# EAGLE design nedo1810_v1_0 (EAGLE 5.01)
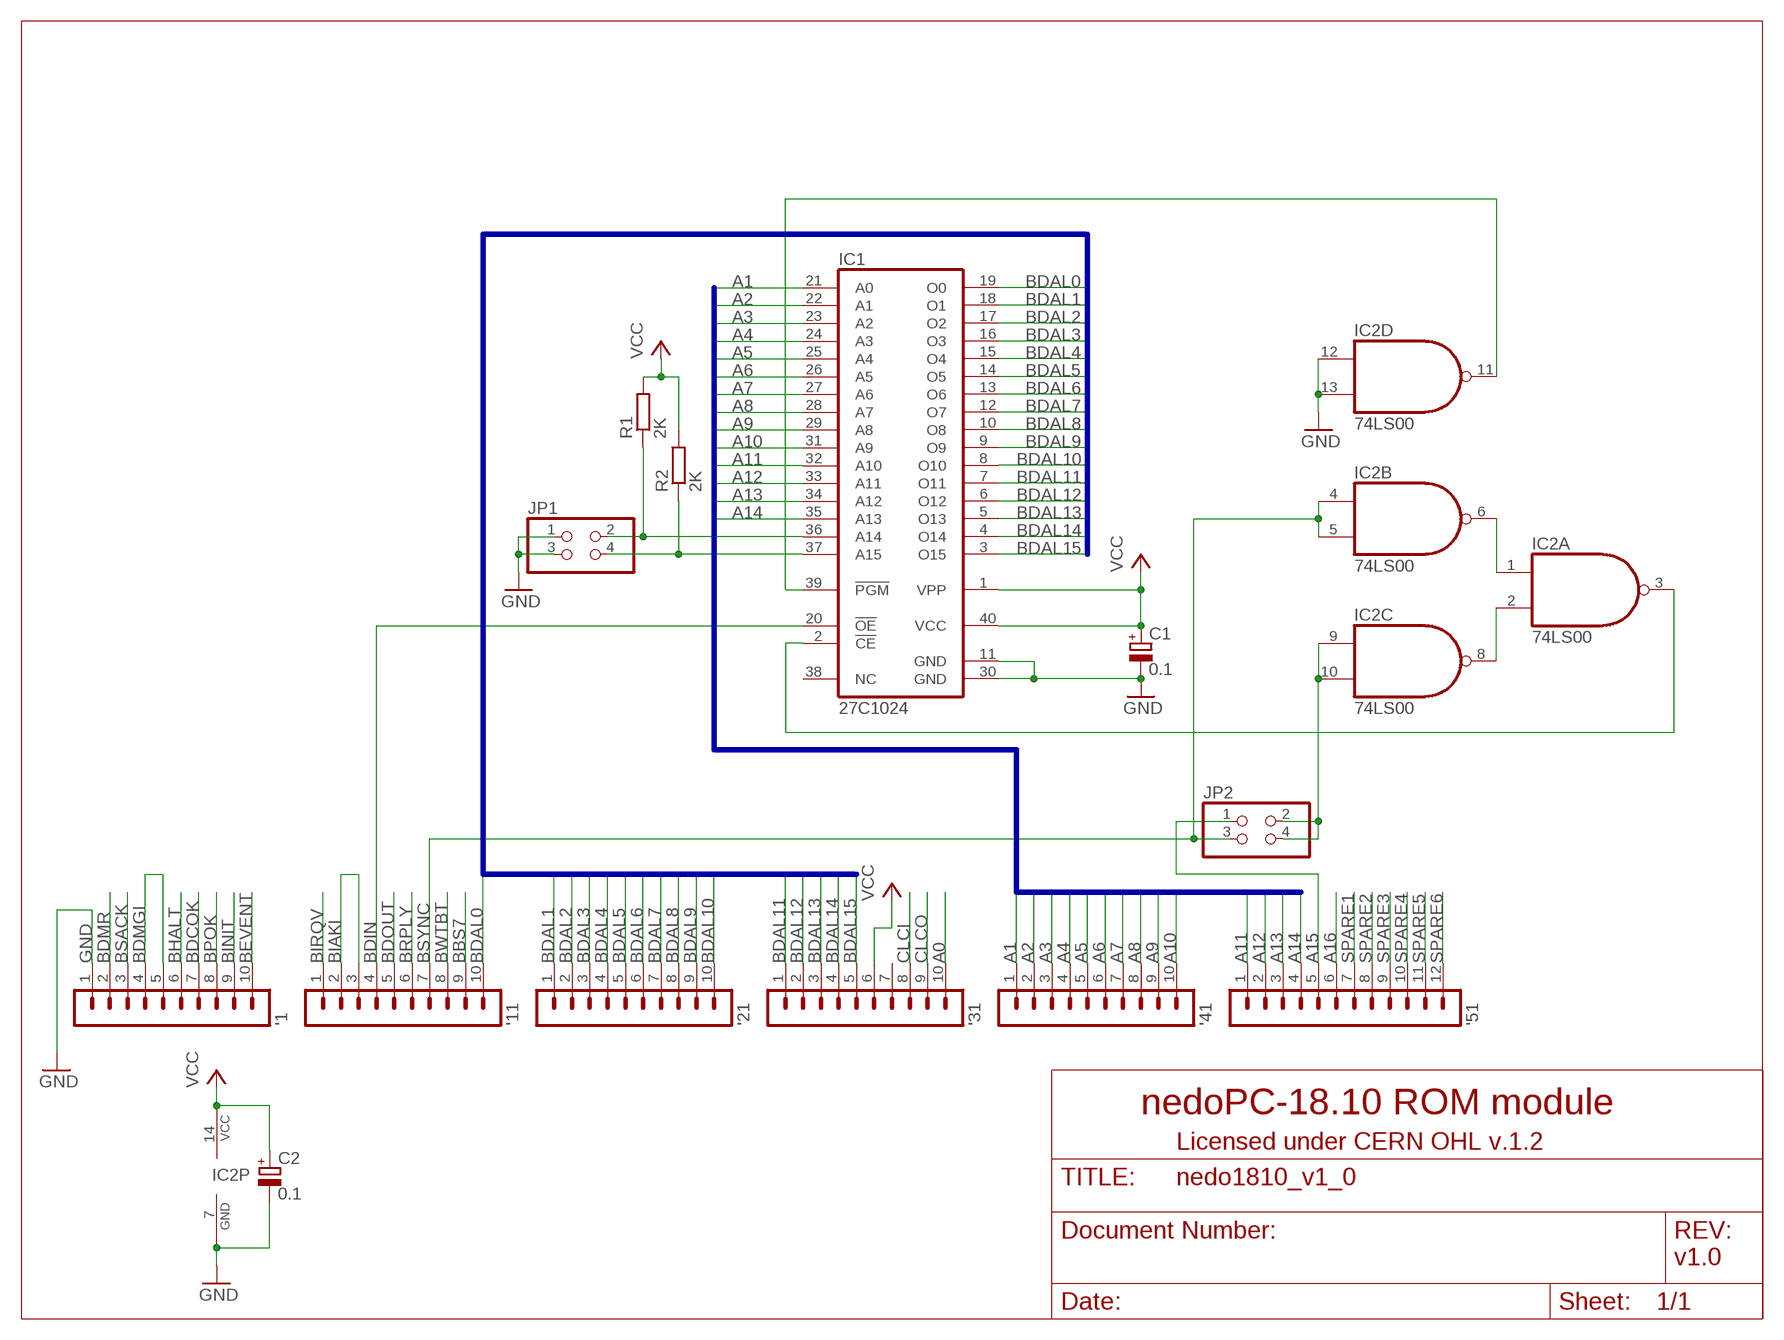
[diagram p0: schematic, sheet 1]

## Parts
'1  MA10-1  [MA10-1]
'11  MA10-1  [MA10-1]
'21  MA10-1  [MA10-1]
'31  MA10-1  [MA10-1]
'41  MA10-1  [MA10-1]
'51  MA12-1  [MA12-1]
C1  0.1  CPOL-EUB45181A  [B45181A]
C2  0.1  CPOL-EUB45181A  [B45181A]
IC1  27C1024  27C1024D  [DIL40]
IC2  74LS00  74S00N  [DIL14]
JP1  PINHD-2X2  [2X02]
JP2  PINHD-2X2  [2X02]
R1  2K  R-EU_0204/7  [0204/7]
R2  2K  R-EU_0204/7  [0204/7]

## Nets
A0: '31.10
A1: '41.1 IC1.21(A0)
A2: '41.2 IC1.22(A1)
A3: '41.3 IC1.23(A2)
A4: '41.4 IC1.24(A3)
A5: '41.5 IC1.25(A4)
A6: '41.6 IC1.26(A5)
A7: '41.7 IC1.27(A6)
A8: '41.8 IC1.28(A7)
A9: '41.9 IC1.29(A8)
A10: '41.10 IC1.31(A9)
A11: '51.1 IC1.32(A10)
A12: '51.2 IC1.33(A11)
A13: '51.3 IC1.34(A12)
A14: '51.4 IC1.35(A13)
A15: '51.5 JP2.1
A16: '51.6
BBS7: '11.9
BDAL0: '11.10 IC1.19(O0)
BDAL1: '21.1 IC1.18(O1)
BDAL2: '21.2 IC1.17(O2)
BDAL3: '21.3 IC1.16(O3)
BDAL4: '21.4 IC1.15(O4)
BDAL5: '21.5 IC1.14(O5)
BDAL6: '21.6 IC1.13(O6)
BDAL7: '21.7 IC1.12(O7)
BDAL8: '21.8 IC1.10(O8)
BDAL9: '21.9 IC1.9(O9)
BDAL10: '21.10 IC1.8(O10)
BDAL11: '31.1 IC1.7(O11)
BDAL12: '31.2 IC1.6(O12)
BDAL13: '31.3 IC1.5(O13)
BDAL14: '31.4 IC1.4(O14)
BDAL15: '31.5 IC1.3(O15)
BDCOK: '1.7
BDIN: '11.4 IC1.20(!OE)
BDMGI: '1.4 '1.5
BDMR: '1.2
BDOUT: '11.5
BEVENT: '1.10
BHALT: '1.6
BIAKI: '11.2 '11.3
BINIT: '1.9
BIRQV: '11.1
BPOK: '1.8
BRPLY: '11.6
BSACK: '1.3
BSYNC: '11.7 IC2.4(B:I0) IC2.5(B:I1) JP2.3
BWTBT: '11.8
CLCI: '31.8
CLCO: '31.9
GND: '1.1 C1.- C2.- IC1.11(GND) IC1.30(GND) IC2.7(P:GND) IC2.12(D:I0) IC2.13(D:I1) JP1.1 JP1.3
N$1: IC1.36(A14) JP1.2 R1.1
N$2: IC1.2(!CE) IC2.3(A:O)
N$3: IC1.37(A15) JP1.4 R2.1
N$5: IC2.9(C:I0) IC2.10(C:I1) JP2.2 JP2.4
N$6: IC1.39(!PGM) IC2.11(D:O)
N$8: IC2.1(A:I0) IC2.6(B:O)
N$9: IC2.2(A:I1) IC2.8(C:O)
SPARE1: '51.7
SPARE2: '51.8
SPARE3: '51.9
SPARE4: '51.10
SPARE5: '51.11
SPARE6: '51.12
VCC: '31.6 C1.+ C2.+ IC1.1(VPP) IC1.40(VCC) IC2.14(P:VCC) R1.2 R2.2
Unconnected: '31.7 IC1.38(NC)

## Buses
A[1..14]
BDAL[0..15]

## Notes on the sheet
- nedoPC-18.10 ROM module
- Licensed under CERN OHL v.1.2
- v1.0

## Library data of the parts
'1 '11 '21 '31 '41 = con-lstb:MA10-1: PIN HEADER
'51 = con-lstb:MA12-1: PIN HEADER
C1 C2 = rcl:CPOL-EU: POLARIZED CAPACITOR, European symbol
IC1 = memory-nec:27C1024D: MEMORY
IC2 = 74xx-us:74*00: Quad 2-input NAND gate
JP1 JP2 = pinhead:PINHD-2X2: PIN HEADER
R1 R2 = rcl:R-EU_: RESISTOR, European symbol

## Board
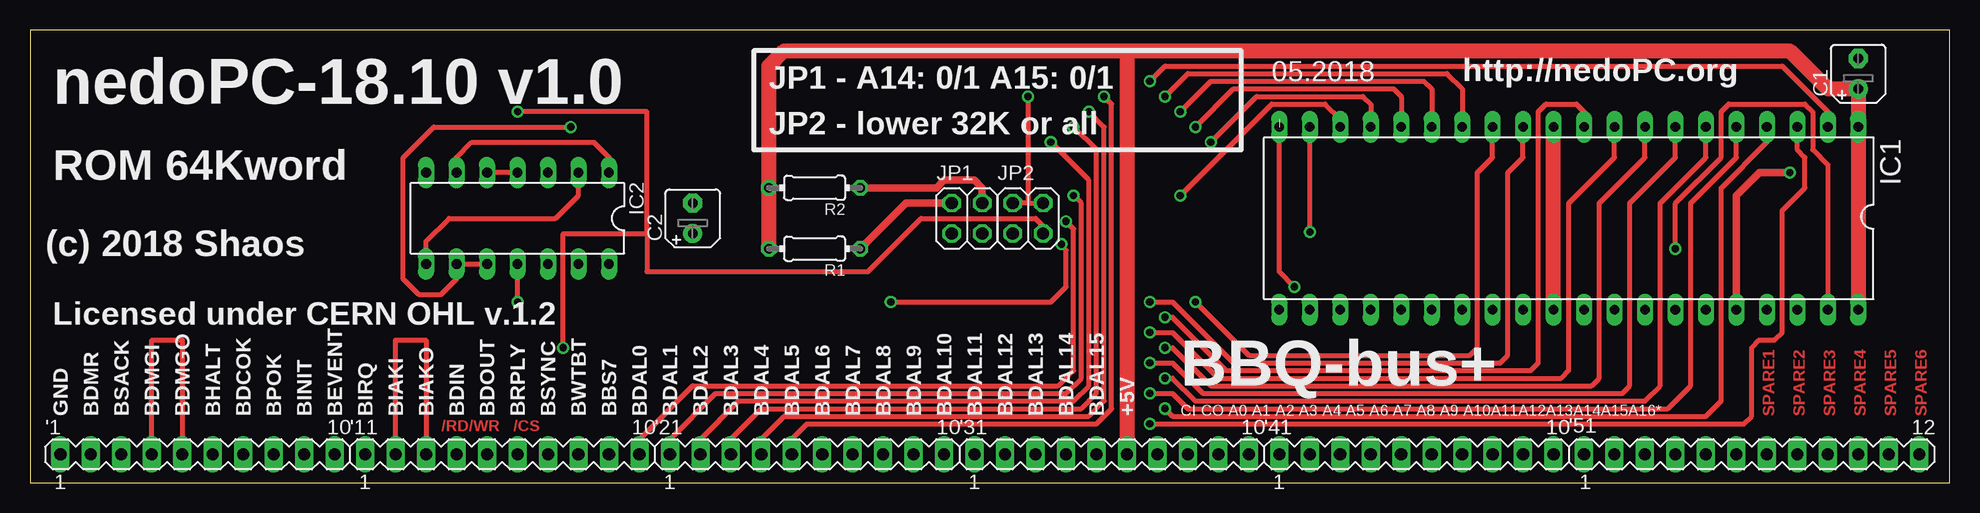
[diagram p1: board, top side]
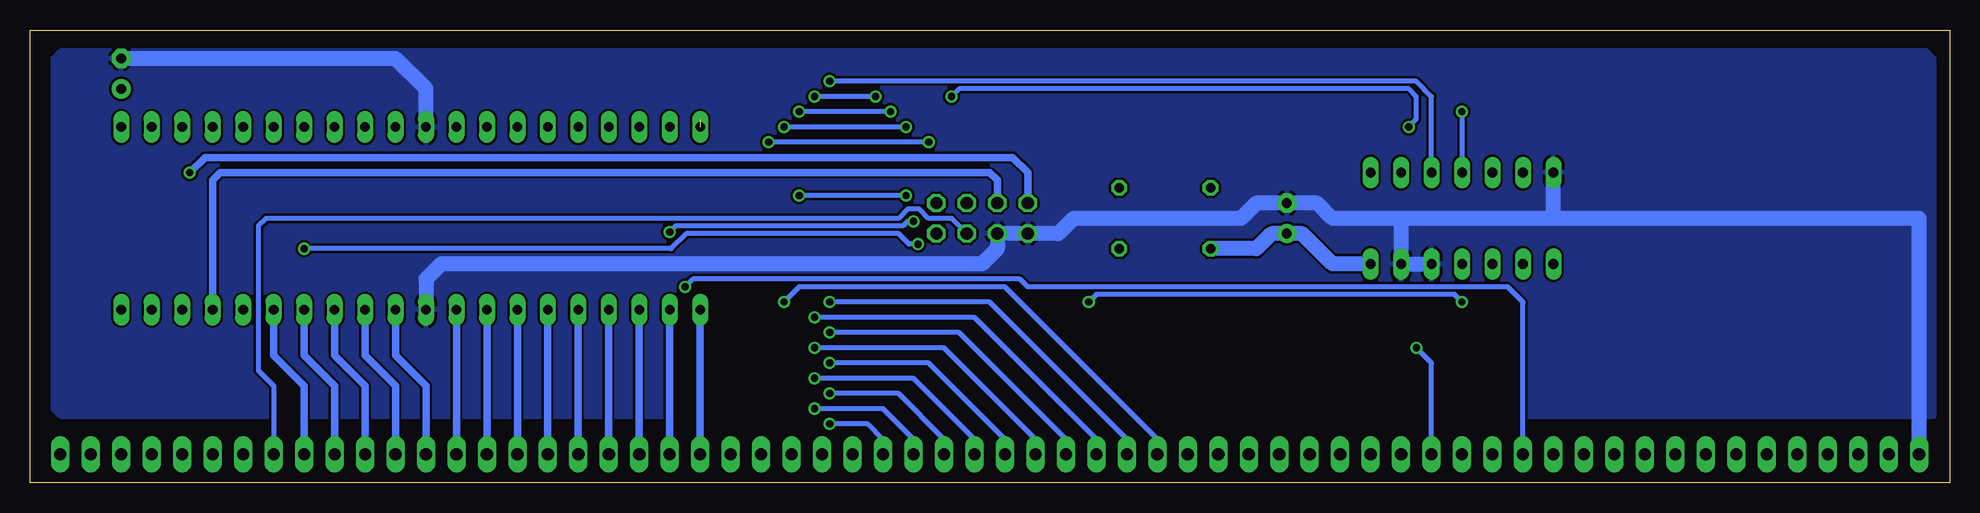
[diagram p2: board, bottom side, seen from below]

Size 160 x 37.77 mm. Coordinates in mm from the lower left corner, seen from the top.
Outline: 0,0 160,0 160,37.77 0,37.77 0,0
Copper layers (1+2*15+16): Top 0.035mm / dielectric 1.5mm / Route2 0.035mm / dielectric 0.15mm / Route15 0.035mm / dielectric 0.2mm / Bottom 0.035mm
Design rules "default *": minimum track width 6mil, minimum drill 20mil, track to track 8mil, track to pad 8mil, pad to pad 8mil, via to via 8mil, smd to smd 8mil, copper to edge 20mil, drill to drill 8mil, minimum pad ring 10mil, minimum via ring 8mil, stop-mask expansion 4mil, vias tented up to drill 0mil, thermal gap 10mil

### Footprints (pad centres in the part's own frame; a part is rotated, then mirrored left to right if it is on the bottom)
MA10-1 = drill 1.016 long: 1 -11.43,0; 2 -8.89,0; 3 -6.35,0; 4 -3.81,0; 5 -1.27,0; 6 1.27,0; 7 3.81,0; 8 6.35,0; 9 8.89,0; 10 11.43,0
MA12-1 = drill 1.016 long: 1 -13.97,0; 2 -11.43,0; 3 -8.89,0; 4 -6.35,0; 5 -3.81,0; 6 -1.27,0; 7 1.27,0; 8 3.81,0; 9 6.35,0; 10 8.89,0; 11 11.43,0; 12 13.97,0
B45181A = drill 0.813 pad 1.6 round: + -1.27,0 | drill 0.813 pad 1.6 octagon: - 1.27,0
DIL40 = drill 0.813 long: 1 -24.13,-7.62; 2 -21.59,-7.62; 3 -19.05,-7.62; 4 -16.51,-7.62; 5 -13.97,-7.62; 6 -11.43,-7.62; 7 -8.89,-7.62; 8 -6.35,-7.62; 9 -3.81,-7.62; 10 -1.27,-7.62; 11 1.27,-7.62; 12 3.81,-7.62; 13 6.35,-7.62; 14 8.89,-7.62; 15 11.43,-7.62; 16 13.97,-7.62; 17 16.51,-7.62; 18 19.05,-7.62; 19 21.59,-7.62; 20 24.13,-7.62; 21 24.13,7.62; 22 21.59,7.62; 23 19.05,7.62; 24 16.51,7.62; 25 13.97,7.62; 26 11.43,7.62; 27 8.89,7.62; 28 6.35,7.62; 29 3.81,7.62; 30 1.27,7.62; 31 -1.27,7.62; 32 -3.81,7.62; 33 -6.35,7.62; 34 -8.89,7.62; 35 -11.43,7.62; 36 -13.97,7.62; 37 -16.51,7.62; 38 -19.05,7.62; 39 -21.59,7.62; 40 -24.13,7.62
DIL14 = drill 0.813 long: 1 -7.62,-3.81; 2 -5.08,-3.81; 3 -2.54,-3.81; 4 0,-3.81; 5 2.54,-3.81; 6 5.08,-3.81; 7 7.62,-3.81; 8 7.62,3.81; 9 5.08,3.81; 10 2.54,3.81; 11 0,3.81; 12 -2.54,3.81; 13 -5.08,3.81; 14 -7.62,3.81
2X02 = drill 1.016 octagon: 1 -1.27,-1.27; 2 -1.27,1.27; 3 1.27,-1.27; 4 1.27,1.27
0204/7 = drill 0.813 octagon: 1 -3.81,0; 2 3.81,0

### Placement (x,y rotation side)
'1  13.97,2.38 0 top
'11  39.37,2.38 0 top
'21  64.77,2.38 0 top
'31  90.16,2.38 0 top
'41  115.56,2.38 0 top
'51  143.5,2.38 0 top
C1  152.39,34.12 90 top
C2  55.24,22.06 90 top
IC1  128.27,22.06 180 top
IC2  40.64,22.06 180 top
JP1  78.1,22.06 0 top
JP2  83.18,22.06 0 top
R1  65.4,19.52 180 top
R2  65.4,24.6 180 top

### Tracks (layer width: path | path; a pad name or v marks a point on that pad's centre or on a via)
A1
  Bottom 0.61: '41.1 IC1.21 104.13,15.08
A2
  Bottom 0.61: '41.2 IC1.22
A3
  Bottom 0.61: '41.3 IC1.23
A4
  Bottom 0.61: '41.4 IC1.24
A5
  Bottom 0.61: '41.5 IC1.25
A6
  Bottom 0.61: '41.6 IC1.26
A7
  Bottom 0.61: '41.7 IC1.27
A8
  Bottom 0.61: '41.8 IC1.28
A9
  Bottom 0.61: '41.9 IC1.29
A10
  Bottom 0.61: '41.10 126.99,8.09 129.53,10.63 IC1.31
A11
  Bottom 0.61: '51.1 129.53,8.09 132.07,10.63 IC1.32
A12
  Bottom 0.61: '51.2 132.07,8.09 134.62,10.63 IC1.33
A13
  Bottom 0.61: '51.3 134.62,8.09 137.16,10.63 IC1.34
A14
  Bottom 0.61: '51.4 137.16,8.09 139.69,10.63 IC1.35
A15
  Bottom 0.406: '51.5 139.69,8.09 140.97,9.36 140.97,21.42 140.33,22.06 87.62,22.06 86.86,22.82 85.85,22.82 85.08,22.06 83.18,22.06 JP2.1
BDAL0  (via drill 0.6)
  Top 0.406: '11.10 50.8,3.64 55.24,8.09 85.72,8.09 86.99,9.36 86.99,21.17 v86.35,21.81 | v106.67,20.92 IC1.19
  Bottom 0.406: v86.35,21.81 86.86,21.81 87.24,21.42 106.17,21.42 v106.67,20.92
BDAL1  (via drill 0.6)
  Top 0.406: IC1.18 109.21,30.31 107.94,31.58 103.5,31.58 v95.88,23.96 | v86.99,23.96 87.62,23.33 87.62,8.73 86.35,7.46 57.15,7.46 53.34,3.64 '21.1
  Bottom 0.406: v86.99,23.96 v95.88,23.96
BDAL2  (via drill 0.6)
  Top 0.406: IC1.17 111.75,31.58 111.12,32.22 102.23,32.22 v98.42,28.41 | v85.08,28.41 88.26,25.23 88.26,8.09 86.99,6.82 59.05,6.82 55.88,3.64 '21.2
  Bottom 0.406: v85.08,28.41 v98.42,28.41
BDAL3  (via drill 0.6)
  Top 0.406: IC1.16 114.3,32.22 113.66,32.85 100.32,32.85 v97.15,29.68 | v86.99,29.68 88.89,27.77 88.89,7.46 87.62,6.18 60.96,6.18 58.41,3.64 '21.3 58.41,1.74
  Bottom 0.406: v86.99,29.68 v97.15,29.68
BDAL4  (via drill 0.6)
  Top 0.406: IC1.15 116.83,32.85 116.2,33.49 98.42,33.49 v95.88,30.95 | v88.26,30.95 89.53,29.68 89.53,6.82 88.26,5.55 62.86,5.55 60.96,3.64 '21.4
  Bottom 0.406: v88.26,30.95 v95.88,30.95
BDAL5  (via drill 0.6)
  Top 0.406: '21.5 63.5,3.64 64.77,4.92 88.89,4.92 90.16,6.18 90.16,31.58 v89.53,32.22 | v94.61,32.22 96.52,34.12 118.1,34.12 119.38,32.85 IC1.14
  Bottom 0.406: v89.53,32.22 v94.61,32.22
BDAL6  (via drill 0.6)
  Top 0.406: v97.15,15.08 101.59,10.63 120.01,10.63 120.64,11.27 120.64,25.87 121.91,27.14 IC1.13
  Bottom 0.406: '21.6 66.03,3.64 78.73,16.34 95.88,16.34 v97.15,15.08
BDAL7  (via drill 0.6)
  Top 0.406: v93.34,15.08 95.24,15.08 100.32,10 122.55,10 123.19,10.63 123.19,25.87 124.45,27.14 IC1.12
  Bottom 0.406: '21.7 68.57,3.64 80,15.08 v93.34,15.08
BDAL8  (via drill 0.6)
  Top 0.406: IC1.10 129.53,30.95 128.9,31.58 126.36,31.58 125.72,30.95 125.72,10 125.09,9.36 99.69,9.36 95.24,13.81 v94.61,13.81
  Bottom 0.406: v94.61,13.81 81.27,13.81 71.11,3.64 '21.8
BDAL9  (via drill 0.6)
  Top 0.406: v93.34,12.54 95.24,12.54 99.05,8.73 127.63,8.73 128.27,9.36 128.27,23.33 132.07,27.14 IC1.9
  Bottom 0.406: '21.9 73.66,3.64 82.55,12.54 v93.34,12.54
BDAL10  (via drill 0.6)
  Top 0.406: IC1.8 134.62,27.14 130.81,23.33 130.81,8.73 130.17,8.09 98.42,8.09 95.24,11.27 v94.61,11.27
  Bottom 0.406: v94.61,11.27 83.81,11.27 76.19,3.64 '21.10
BDAL11  (via drill 0.6)
  Top 0.406: v93.34,10 95.24,10 97.78,7.46 132.71,7.46 133.34,8.09 133.34,23.33 137.16,27.14 IC1.7
  Bottom 0.406: '31.1 78.73,3.64 85.08,10 v93.34,10
BDAL12  (via drill 0.6)
  Top 0.406: IC1.6 139.69,27.14 135.88,23.33 135.88,8.09 134.62,6.82 97.15,6.82 95.24,8.73 v94.61,8.73
  Bottom 0.406: v94.61,8.73 86.35,8.73 81.27,3.64 '31.2
BDAL13  (via drill 0.6)
  Top 0.406: v93.34,7.46 95.24,7.46 96.52,6.18 136.52,6.18 138.42,8.09 138.42,23.33 142.23,27.14 IC1.5
  Bottom 0.406: '31.3 83.81,3.64 87.62,7.46 v93.34,7.46
BDAL14  (via drill 0.6)
  Top 0.406: IC1.4 144.78,28.41 140.97,24.6 140.97,6.82 139.69,5.55 95.24,5.55 v94.61,6.18
  Bottom 0.406: v94.61,6.18 88.89,6.18 86.35,3.64 '31.4
BDAL15  (via drill 0.6)
  Top 0.406: v93.34,4.92 142.87,4.92 143.5,5.55 143.5,11.27 144.14,11.9 145.41,11.9 146.04,12.54 146.04,22.7 147.95,24.6 147.95,27.14 147.31,27.77 IC1.3
  Bottom 0.406: '31.5 88.89,3.64 90.16,4.92 v93.34,4.92
BDIN  (via drill 0.6)  (1 unrouted)
  Top 0.406: v105.41,16.34 104.13,17.61 104.13,30.31
  Bottom 0.406: '11.4 35.55,15.08 36.83,16.34 76.83,16.34 77.46,16.98 104.77,16.98 v105.41,16.34
BDMGI
  Top 0.406: '1.4 10.16,11.9 12.7,11.9 '1.5
BIAKI
  Top 0.406: 30.47,1.74 '11.2 30.47,11.9 33.02,11.9 '11.3
BSYNC  (via drill 0.6)
  Top 0.406: v44.45,11.27 44.45,20.79 51.43,20.79 | JP2.3 84.45,21.42 83.81,22.06 74.29,22.06 69.84,17.61 51.43,17.61 51.43,20.79 | IC2.4 IC2.5 | v40.64,30.95 51.43,30.95 51.43,20.79
  Bottom 0.406: '11.7 43.18,10 v44.45,11.27 | v40.64,30.95 IC2.4
GND
  Top 1.27: IC1.30 IC1.11
  Bottom 1.27: '1.1 2.54,22.06 33.02,22.06 | 33.02,22.06 45.72,22.06 | 45.72,22.06 51.43,22.06 52.7,23.33 C2.- 57.78,23.33 59.05,22.06 73.02,22.06 74.29,20.79 JP1.1 JP1.3 79.37,19.52 80.64,18.25 125.72,18.25 126.99,16.98 IC1.30 | 33.02,22.06 IC2.7 | IC2.12 IC2.13 45.72,22.06 | IC1.11 126.99,32.85 129.53,35.39 C1.-
  pour Bottom: 1.27,5.55 1.27,35.39 1.9,36.03 157.47,36.03 158.11,35.39 158.11,6.18 157.47,5.55
N$1  (via drill 0.6)
  Top 0.61: v146.68,25.87 144.14,25.87 142.23,23.96 IC1.36 | R1.1 73.02,23.33 JP1.2
  Bottom 0.61: JP1.2 76.83,25.87 78.1,27.14 145.41,27.14 v146.68,25.87
N$2  (via drill 0.6)
  Top 0.406: IC1.2 149.85,30.95 146.04,34.76 94.61,34.76 v93.34,33.49
  Bottom 0.406: v93.34,33.49 44.45,33.49 43.18,32.22 IC2.3
N$3
  Top 0.61: R2.1 75.56,24.6 76.19,25.23 78.73,25.23 79.37,24.6 JP1.4
  Bottom 0.61: IC1.37 144.78,25.23 144.14,25.87 80,25.87 79.37,25.23 JP1.4
N$5  (via drill 0.6)
  Top 0.406: v83.18,32.22 83.18,23.33 | 83.18,23.33 JP2.4 | IC2.10 IC2.9 35.55,16.98 34.29,15.71 32.38,15.71 31.11,16.98 31.11,27.14 33.65,29.68 v45.08,29.68 | 83.18,23.33 JP2.2
  Bottom 0.406: v83.18,32.22 82.55,32.85 45.08,32.85 44.45,32.22 44.45,30.31 v45.08,29.68
N$6  (via drill 0.6)
  Top 0.406: v40.64,15.08 IC2.11 | v71.75,15.08 85.08,15.08 86.35,16.34 86.35,19.39 v85.97,19.9 | v137.16,19.52 137.16,23.33 140.97,27.14 140.97,30.95 141.6,31.58 147.95,31.58 148.59,30.95 148.59,27.77 149.85,26.5 IC1.39
  Bottom 0.406: v40.64,15.08 41.27,15.71 71.11,15.71 v71.75,15.08 | v85.97,19.9 86.74,19.9 87.62,20.79 105.28,20.79 106.55,19.52 v137.16,19.52
N$8
  Top 0.406: IC2.6 35.55,27.14 36.83,28.41 46.98,28.41 48.26,27.14 IC2.1
N$9
  Top 0.406: IC2.8 33.02,20.15 34.92,22.06 43.81,22.06 45.72,23.96 IC2.2
VCC
  Top 1.27: 91.44,36.03 '31.6 | 91.44,36.03 146.68,36.03 149.85,32.85 C1.+ IC1.1 IC1.40 | R1.2 R2.2 61.59,34.76 62.86,36.03 91.44,36.03
  Bottom 1.27: R1.2 57.78,19.52 56.51,20.79 C2.+ 53.97,20.79 51.43,18.25 IC2.14

### Text on the board
Top: SPARE1 | SPARE2 | SPARE3 | SPARE4 | SPARE5 | SPARE6 | /RD/WR /CS
tNames: 05.2018 | http://nedoPC.org | JP1 - A14: 0/1 A15: 0/1 | nedoPC-18.10 v1.0 | JP2 - lower 32K or all | ROM 64Kword | (c) 2018 Shaos | Licensed under CERN OHL v.1.2 | BBQ-bus+ | GND | BDMR | BSACK | BDMGI | BDMGO | BHALT | BDCOK | BPOK | BINIT | BEVENT | BIRQ | BIAKI | BIAKO | BDIN | BDOUT | BRPLY | BSYNC | BWTBT | BBS7 | BDAL0 | BDAL1 | BDAL2 | BDAL3 | BDAL4 | BDAL5 | BDAL6 | BDAL7 | BDAL8 | BDAL9 | BDAL10 | BDAL11 | BDAL12 | BDAL13 | BDAL14 | BDAL15 | +5V | CI CO A0 A1 A2 A3 A4 A5 A6 A7 A8 A9 A10A11A12A13A14A15A16*